# EasyEDA Pro project ProProject_ReuleauxTriangle_2023-12-03.epro

# Schematic Schematic1
Create Date: 2023-11-23; Page Name: P1; Project Name: ReuleauxTriangle; Schematic Name: Schematic1; Update Date: 2023-11-29; Company: 嘉立创EDA; Page Size: A4; Version: V1.0
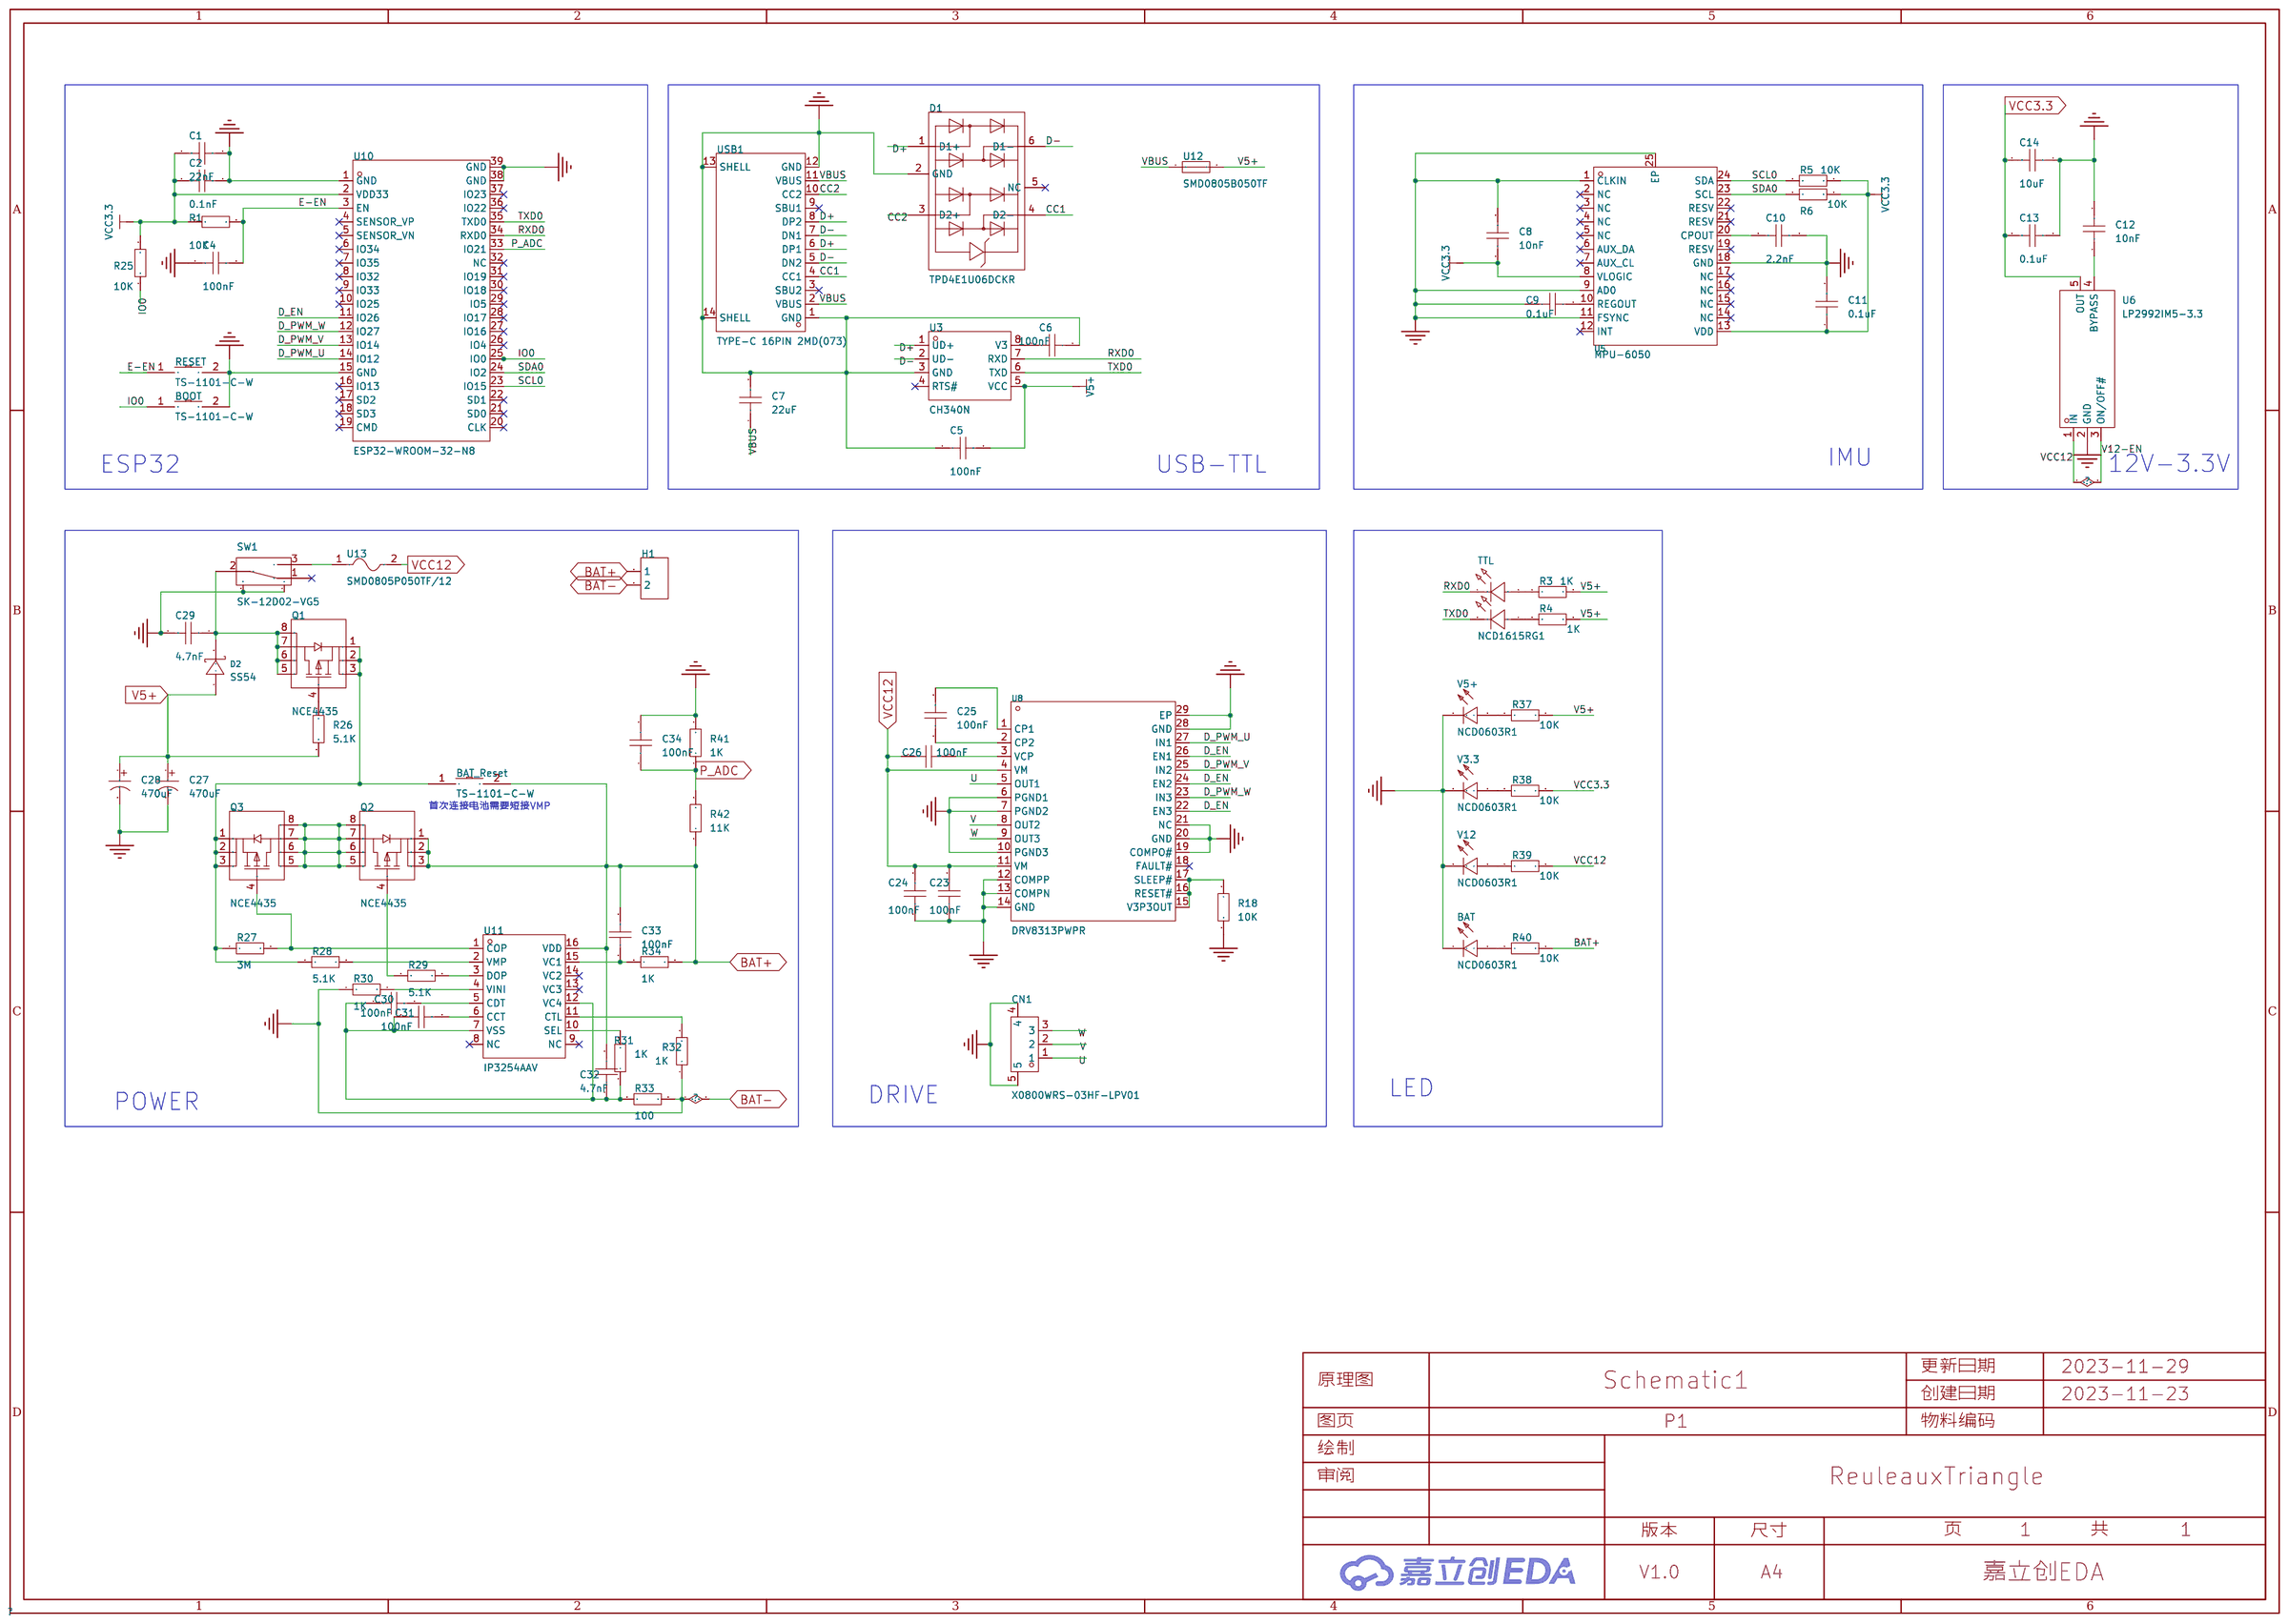
[diagram p0: schematic sheet]

## Parts
BAT  NCD0603R1  [LED0603-RD_RED]
BAT_Reset  TS-1101-C-W  [SW-SMD_L6.0-W3.3-LS8.0]
BOOT  TS-1101-C-W  [SW-SMD_L6.0-W3.3-LS8.0]
C1  22nF  [C0402]
C2  0.1nF  [C0402]
C4  100nF  [C0402]
C5  100nF  [C0402]
C6  100nF  [C0402]
C7  22uF  [C0402]
C8  10nF  [C0402]
C9  0.1uF  [C0402]
C10  2.2nF  [C0402]
C11  0.1uF  [C0402]
C12  10nF  [C0402]
C13  0.1uF  [C0402]
C14  10uF  [C0402]
C23  100nF  [C0402]
C24  100nF  [C0402]
C25  100nF  [C0402]
C26  100nF  [C0402]
C27  470uF  [CAP-SMD_BD10.0-L10.3-W10.3-FD]
C28  470uF  [CAP-SMD_BD10.0-L10.3-W10.3-FD]
C29  4.7nF  [C0402]
C30  100nF  [C0402]
C31  100nF  [C0402]
C32  4.7nF  [C0402]
C33  100nF  [C0402]
C34  100nF  [C0402]
CN1  X0800WRS-03HF-LPV01  [CONN-SMD_X0800WRS-03HF-LPV01]
D1  TPD4E1U06DCKR  [SC-70-6_L2.2-W1.3-P0.65-LS2.1-BL]
D2  SS54  [SMA_L4.4-W2.8-LS5.4-R-RD]
H1  -  [HDR-TH_2P-P2.54-V-F]
Q1  NCE4435  [SOP-8_L5.0-W4.0-P1.27-LS6.2-BL]
Q2  NCE4435  [SOP-8_L5.0-W4.0-P1.27-LS6.2-BL]
Q3  NCE4435  [SOP-8_L5.0-W4.0-P1.27-LS6.2-BL]
R1  10K  [R0402]
R3  1K  [R0402]
R4  1K  [R0402]
R5  10K  [R0402]
R6  10K  [R0402]
R18  10K  [R0402]
R25  10K  [R0402]
R26  5.1K  [R0402]
R27  3M  [R0402]
R28  5.1K  [R0402]
R29  5.1K  [R0402]
R30  1K  [R0402]
R31  1K  [R0402]
R32  1K  [R0402]
R33  100  [R0402]
R34  1K  [R0402]
R37  10K  [R0402]
R38  10K  [R0402]
R39  10K  [R0402]
R40  10K  [R0402]
R41  1K  [R0402]
R42  11K  [R0402]
RESET  TS-1101-C-W  [SW-SMD_L6.0-W3.3-LS8.0]
SW1  SK-12D02-VG5  [SW-TH_SK-12D02-VG5]
TTL  NCD1615RG1  [LED-SMD_4P-L1.6-W1.5-TL-1]
U3  CH340N  [SOP-8_L4.9-W3.9-P1.27-LS6.0-BL]
U5  MPU-6050  [QFN-24_L4.0-W4.0-P0.50-BL-EP2.7]
U6  LP2992IM5-3.3  [SOT-23-5_L2.9-W1.6-P0.95-LS2.8-BL]
U8  DRV8313PWPR  [HTSSOP-28_L9.8-W4.5-P0.65-LS6.6-BL-EP]
U10  ESP32-WROOM-32-N8  [WIFIM-SMD_39P-L25.5-W18.0-P1.27]
U11  IP3254AAV  [TSSOP-16_L5.0-W4.4-P0.65-LS6.4-BL]
U12  SMD0805B050TF  [F0805]
U13  SMD0805P050TF/12  [F0805]
USB1  TYPE-C 16PIN 2MD(073)  [USB-C-SMD_TYPE-C-6PIN-2MD-073]
V3.3  NCD0603R1  [LED0603-RD_RED]
V5+  NCD0603R1  [LED0603-RD_RED]
V12  NCD0603R1  [LED0603-RD_RED]

## Library data of the parts
BAT V3.3 V5+ V12 = NCD0603R1_C84263: 发光颜色:红色;功率:65mW;透镜颜色:无色透明;主波长:615nm~630nm;发光强度:80mcd~220mcd;发光角度:130°;工作温度:-30℃~+85℃;; LCSC Part Name: 红灯 0603红灯   正贴; Supplier Part: C84263; Manufacturer: 国星光电; Supplier Footprint: 0603; JLCPCB Part Class: Extended Part; Datasheet: https://atta.szlcsc.com/upload/public/pdf/source/20200820/C84263_DABC6A75E58F576973B407FDBA283D60.pdf; Supplier: LCSC; Emitted Color: 红色; Forward Voltage (VF): 1.6V~2.6V; Forward Current: 20mA; Power Dissipation: 65mW; Lens Color: 无色透明; Dominant Wavelength: 615nm~630nm; Luminous Intensity: 80mcd~220mcd; Viewing Angle: 130°; Operating Temperature: -30℃~+85℃
BAT_Reset BOOT RESET = TS-1101-C-W: 电路结构:单刀单掷;带支架:否;触点电流:50mA;额定电压(AC):-;额定电压(DC):12V;额定功率:-;安装方式:立贴;绝缘电阻:-;带灯:无;作用力:260gf;机械寿命:5万次;; LCSC Part Name: 6*3.6*2.5mm 立贴 轻触开关 白色带淡绿按键 卷装; Supplier Part: C318938; Manufacturer: XKB Connectivity(中国星坤); Supplier Footprint: SMD; JLCPCB Part Class: Extended Part; Datasheet: https://atta.szlcsc.com/upload/public/pdf/source/20200227/C318938_C2E53B1EEDE37D980A33616AC086DE53.pdf; Supplier: LCSC; Circuit: 单刀单掷; Actuator Style: 矩形按钮; Switch Length: 6mm; Switch Width: 3.6mm; Switch Height: 2.5mm; Strike Gundam: 否; Contact Current: 50mA; Voltage Rating (DC): 12V; Mounting Style: 立贴; Actuator/Cap Color: 白色带淡绿; With Lamp: 无; Operating Force: 260gf; Mechanical Life: 5万次; Operating Temperature: -30℃~+85℃
C1 C2 C4-C14 C23-C26 C29-C34 = CAP_0402: Supplier Footprint: 0402
C27 C28 = RVT1V471M1010: 容值:470uF;精度:±20%;额定电压:35V;纹波电流:-;等效串联电阻:-;; LCSC Part Name: 470uF ±20% 35V; Supplier Part: C3350; Manufacturer: HONOR(荣誉); Supplier Footprint: SMD,D10xL10.2mm; JLCPCB Part Class: Extended Part; Datasheet: https://atta.szlcsc.com/upload/public/pdf/source/20210521/C113284_25C86AE95FB541053FE695F13EA8E7D0.pdf; Supplier: LCSC; Tolerance: ±20%; Rated Voltage: 35V; φD: 10mm; L: 10.2mm; Lifetime @ Temp: 2000hrs@105℃; Operating Temperature: -55℃~+105℃
CN1 = X0800WRS-03HF-LPV01: 参考系列:-;间距:0.8mm;插针结构:1x3P;排数:1;每排PIN数:3;行距:-;公母:公型插针;安装方式:卧贴;额定电流:500mA;触头材质:磷青铜;触头镀层:金;工作温度范围:-25℃~+85℃;焊接温度(最大值):260℃;; LCSC Part Name: 间距:0.8mm 1x3P 卧贴 镀金 替代JST; Supplier Part: C500138; Manufacturer: XKB Connectivity(中国星坤); Supplier Footprint: SMD,P=0.8mm; JLCPCB Part Class: Extended Part; Datasheet: https://atta.szlcsc.com/upload/public/pdf/source/20211011/3A0802A09DD608D3DCC2D13C156B7911.pdf; Supplier: LCSC; Pitch: 0.8mm; Pins Structure: 1x3P; Number of Rows: 1; Number of PINs Per Row: 3; Gender: 公型插针; Mounting Style: 卧贴; Current Rating (Max): 500mA; Contact Material: 磷青铜; Contact Plating: 金; Operating Temperature Range: -25℃~+85℃; Welding Temperature (Max): 260℃
D1 = TPD4E1U06DCKR: 极性:单向;反向截止电压(Vrwm):5.5V;击穿电压(VBR):6.5V;钳位电压(Vc)@Ipp:15V;; LCSC Part Name: 单向ESD; Supplier Part: C194628; Manufacturer: TI(德州仪器); Supplier Footprint: SOT-363; JLCPCB Part Class: Extended Part; Datasheet: https://atta.szlcsc.com/upload/public/pdf/source/20180625/C194628_A458CD25029D59CDC67787AEC4B36401.pdf; Supplier: LCSC; Polarity: 单向; Reverse Stand-Off Voltage (Vrwm): 5.5V; Breakdown Voltage (VBR): 6.5V; Peak Pulse Current(Ipp)@8/20us: 3A; Clamping Voltage@Ipp: 15V; Peak Pulse Power(Ppp)@8/20us: 45W; Operating Temperature: -40℃~+125℃@(Ta)
D2 = SS54_C22452: 直流反向耐压（Vr）:40V;平均整流电流（Io）:5A;正向压降（Vf）:550mV @ 5A;; Supplier Part: C22452; Manufacturer: MDD; Supplier Footprint: SMA(DO-214AC); JLCPCB Part Class: Basic Part; Supplier: LCSC
H1 = HDR-F_2.54_1x2P: Supplier Part: C49661; Supplier Footprint: 插件
Q1-Q3 = NCE4435: 类型:P沟道;漏源电压(Vdss):30V;连续漏极电流(Id):9.1A;功率(Pd):3.1W;导通电阻(RDS(on)@Vgs,Id):20mΩ@10V,9.1A;阈值电压(Vgs(th)@Id):3V@250uA;; LCSC Part Name: P沟道 30V 9.1A; Supplier Part: C95275; Manufacturer: NCE(无锡新洁能); Supplier Footprint: SOP-8; JLCPCB Part Class: 扩展库; Datasheet: https://atta.szlcsc.com/upload/public/pdf/source/20170211/1486785674640.pdf; Supplier: LCSC; Type: P沟道; Drain Source Voltage (Vdss): 30V; Continuous Drain Current (Id): 9.1A; Power Dissipation (Pd): 3.1W; Drain Source On Resistance (RDS(on)@Vgs,Id): 20mΩ@10V,9.1A; Gate Threshold Voltage (Vgs(th)@Id): 3V@250uA
R1 R3-R6 R18 R25-R34 R37-R42 = Res_0402: Supplier Footprint: 0402
SW1 = SK-12D02-VG5_C136722: 额定电流(DC):-;额定电压(DC):-;额定电流(AC):-;额定电压(AC):-;电路结构:单刀双掷;安装方式:卧插;机械寿命:5千次;; LCSC Part Name: 卧插双档 滑动开关; Supplier Part: C136722; Manufacturer: 韩国韩荣; Supplier Footprint: 插件; JLCPCB Part Class: 扩展库; Datasheet: https://atta.szlcsc.com/upload/public/pdf/source/20180731/C136723_39114FC09BF2E9DC98823B78B7234B45.pdf; Supplier: LCSC; Circuit: 单刀双掷; Mounting Style: 卧插; Mechanical Life: 5千次; Actuator Style: 矩形柱状; Pin Style: PC引脚; Operating Temperature: -25℃~+70℃; Switch Height: 9.5mm
TTL = NCD1615RG1: 发光颜色:橙红色,翠绿色;二极管配置:-;功率:72mW；52mW;透镜颜色:-;主波长:625nm；525nm;色温:-;发光强度:260mcd；150mcd;发光角度:130°;安装方式:-;工作温度:-30℃~+85℃;; LCSC Part Name: 红灯,翠绿 正贴 1615  双色LED; Supplier Part: C2917181; Manufacturer: 国星光电; Supplier Footprint: 0606; JLCPCB Part Class: Extended Part; Datasheet: https://atta.szlcsc.com/upload/public/pdf/source/20211124/E2F3DD35E9AE2C38D361CFFAAFF6A77F.pdf; Supplier: LCSC; Emitted Color: 橙红色,翠绿色; Forward Voltage (VF): 3.2V；2V; Forward Current: 20mA; Power Dissipation: 72mW；52mW; Dominant Wavelength: 625nm；525nm; Luminous Intensity: 260mcd；150mcd; Viewing Angle: 130°; Operating Temperature: -30℃~+85℃
U3 = CH340N: LCSC Part Name: USB转串口芯片 CH340; Supplier Part: C2977777; Manufacturer: WCH(南京沁恒); Supplier Footprint: SOP-8; JLCPCB Part Class: 扩展库; Datasheet: https://atta.szlcsc.com/upload/public/pdf/source/20230530/6E401E9554E9F5311886CC8B3F89B62E.pdf; Supplier: LCSC
U5 = MPU-6050: 三轴加速度计和三轴陀螺仪，工作电压：2.375V~3.46V; Supplier Part: C24112; Manufacturer: TDK InvenSense(应美盛); Supplier Footprint: QFN-24(4x4); JLCPCB Part Class: 扩展库; Datasheet: https://atta.szlcsc.com/upload/public/pdf/source/20140425/1457707046159.pdf; Supplier: LCSC
U6 = LP2992IM5-3.3: 输出类型:固定;输出极性:正;最大输入电压:16V;输出电压:3.3V;输出电流:250mA;电源纹波抑制比(PSRR):45dB@(1kHz);; Supplier Part: C3751592; Manufacturer: TI(德州仪器); Supplier Footprint: SOT-23-5; JLCPCB Part Class: 扩展库; Supplier: LCSC; Output Type: 固定; Output Polarity: 正; Number of Outputs: 1; Maximum Input Voltage: 16V; Output Voltage: 3.3V; Dropout Voltage: 850mV@(250mA); Quiescent Current (Ground Current): 95uA; Output Current: 250mA; Power Supply Rejection Ratio (PSRR): 45dB@(1kHz); Feature: 过流保护；过热保护; Operating Temperature: -40℃~+125℃@(Tj)
U8 = DRV8313PWPR: 类型:无刷直流BLDC;电源电压:8V~60V;输出电流:-;接口:并行;; LCSC Part Name: 无刷直流BLDC电机驱动芯片 60V; Supplier Part: C92482; Manufacturer: TI(德州仪器); Supplier Footprint: TSSOP-28-EP; JLCPCB Part Class: 扩展库; Datasheet: https://www.ti.com/cn/lit/gpn/drv8313; Supplier: LCSC; Type: 无刷直流BLDC; Supply Voltage: 8V~60V; Interface: 并行; Operating Temperature: -40℃~+150℃@(Tj)
U10 = ESP32-WROOM-32-N8: Supplier Part: C529582; Manufacturer: ESPRESSIF(乐鑫); Supplier Footprint: SMD,18x25.5mm; JLCPCB Part Class: Extended Part; Datasheet: https://atta.szlcsc.com/upload/public/pdf/source/20200521/C529581_8F7B9F041ADB7CF235FBC8D159B9C4FF.pdf; Supplier: LCSC
U11 = IP3254AAV: Supplier Part: C384569; Manufacturer: INJOINIC(英集芯); Supplier Footprint: TSSOP-16; JLCPCB Part Class: 扩展库; Datasheet: https://atta.szlcsc.com/upload/public/pdf/source/20190627/C384569_A25975C6DA0D38CB62CDBD6469AC3DAB.pdf; Supplier: LCSC
U12 = SMD0805B050TF: 最大电压:6V;最大电流:100A;保持电流:500mA;跳闸电流:1A;; LCSC Part Name: 6V 500mA 0805自恢复; Supplier Part: C269104; Manufacturer: Brightking(君耀电子); Supplier Footprint: 0805; JLCPCB Part Class: 扩展库; Datasheet: https://atta.szlcsc.com/upload/public/pdf/source/20180814/C269104_466839A5DB65F6E723CA6A162ACE747B.pdf; Supplier: LCSC; Operating Voltage (Max): 6V; Current Rating (Max): 100A; Hold Current: 500mA; Trip Current: 1A; Maximum Time to Trip: 100ms
U13 = SMD0805P050TF/12: 最大电压:12V;最大电流:100A;保持电流:500mA;跳闸电流:1A;; LCSC Part Name: 12V 500mA 0805自恢复; Supplier Part: C90129; Manufacturer: RUILON(瑞隆源); Supplier Footprint: 0805; JLCPCB Part Class: Extended Part; Datasheet: https://atta.szlcsc.com/upload/public/pdf/source/20180621/C90129_682C2B239333F36385CA0609A87C55A0.pdf; Supplier: LCSC; Operating Voltage (Max): 12V; Current Rating (Max): 100A; Hold Current: 500mA; Trip Current: 1A
USB1 = TYPE-C 16PIN 2MD(073): 连接器类型:Type-C;标准:-;公母:母;触点数量:16P;端口数量:1;安装方式:卧贴;额定电流 - 电源:5A;工作温度范围:-25℃~+85℃;; LCSC Part Name: Type-C 母 卧贴 带定位柱 不锈钢外壳 2次模顶; Supplier Part: C2765186; Manufacturer: SHOU HAN(首韩); Supplier Footprint: SMD; JLCPCB Part Class: 扩展库; Datasheet: https://atta.szlcsc.com/upload/public/pdf/source/20211123/39B17C16241EAC15C5E277BDA434118E.pdf; Supplier: LCSC; Connector Type: Type-C; Gender: 母; Number of Contacts: 16P; Number of Ports: 1; Mounting Style: 卧贴; Current Rating - Power (Max): 5A; Operating Temperature Range: -25℃~+85℃

## Nets
GND: BAT.1(K) BOOT.2 C1.1 C2.2 C4.1 C5.1 C6.2 C7.2 C8.2 C9.1 C10.2 C11.2 C12.2 C13.1 C14.1 C23.1 C24.1 C27.2 C28.2 C29.2 C34.2 CN1.4 CN1.5 D1.2(GND) H1.2 R18.2 R30.1 R32.1 R33.2 R41.2 RESET.2 SW1.4 SW1.5 U3.3(GND) U5.1(CLKIN) U5.9(AD0) U5.11(FSYNC) U5.18(GND) U5.25(EP) U6.2(GND) U8.6(PGND1) U8.7(PGND2) U8.10(PGND3) U8.12(COMPP) U8.13(COMPN) U8.14(GND) U8.19(COMPO#) U8.20(GND) U8.21(NC) U8.28(GND) U8.29(EP) U10.1(GND) U10.15(GND) U10.38(GND) U10.39(GND) USB1.1(GND) USB1.12(GND) USB1.13(SHELL) USB1.14(SHELL) V3.3.1(K) V5+.1(K) V12.1(K)
V5+: C5.2 C27.1 C28.1 D2.1(A) R3.2 R4.2 R26.2 R37.2 U3.5(VCC) U12.2
V12-EN: C23.2 C24.2 C26.1 R39.2 U6.1(IN) U6.3(ON/OFF#) U8.4(VM) U8.11(VM) U13.2
VBUS: C7.1 U12.1 USB1.2(VBUS) USB1.11(VBUS)
VCC3.3: C1.2 C2.1 C8.1 C11.1 C13.2 C14.2 R1.1 R5.2 R6.2 R25.2 R38.2 U5.8(VLOGIC) U5.13(VDD) U6.5(OUT) U10.2(VDD33)
BAT+: BAT_Reset.2 C32.2 C33.2 H1.1 Q2.1(S) Q2.2(S) Q2.3(S) R34.2 R40.2 R42.1 U11.16(VDD)
CC1: D1.4(D2-) USB1.4(CC1)
CC2: D1.3(D2+) USB1.10(CC2)
D+: D1.1(D1+) U3.1(UD+) USB1.6(DP1) USB1.8(DP2)
D-: D1.6(D1-) U3.2(UD-) USB1.5(DN2) USB1.7(DN1)
D_EN: U8.22(EN3) U8.24(EN2) U8.26(EN1) U10.11(IO26)
D_PWM_U: U8.27(IN1) U10.14(IO12)
D_PWM_V: U8.25(IN2) U10.13(IO14)
D_PWM_W: U8.23(IN3) U10.12(IO27)
E-EN: C4.2 R1.2 RESET.1 U10.3(EN)
IO0: BOOT.1 R25.1 U10.25(IO0)
P_ADC: C34.1 R41.1 R42.2 U10.33(IO21)
RXD0: TTL.1(R-) U3.7(RXD) U10.34(RXD0)
SCL0: R5.1 U5.24(SDA) U10.23(IO15)
SDA0: R6.1 U5.23(SCL) U10.24(IO2)
TXD0: TTL.3(UG-) U3.6(TXD) U10.35(TXD0)
U: CN1.1 U8.5(OUT1)
V: CN1.2 U8.8(OUT2)
W: CN1.3 U8.9(OUT3)
$1N4426: C6.1 U3.8(V3)
$1N4742: R3.1 TTL.2(+R)
$1N4768: R4.1 TTL.4(+UG)
$1N6012: C9.2 U5.10(REGOUT)
$1N6344: C10.1 U5.20(CPOUT)
$1N6735: C12.1 U6.4(BYPASS)
$1N10947: R18.1 U8.15(V3P3OUT) U8.16(RESET#) U8.17(SLEEP#)
$1N11170: C25.2 U8.1(CP1)
$1N11174: C25.1 U8.2(CP2)
$1N11246: C26.2 U8.3(VCP)
$1N21068: Q1.4(G) R26.1
$1N21616: Q2.5(D) Q2.6(D) Q2.7(D) Q2.8(D) Q3.5(D) Q3.6(D) Q3.7(D) Q3.8(D)
$1N22205: Q2.4(G) R29.1
$1N22284: R28.2 U11.2(VMP)
$1N22287: R29.2 U11.3(DOP)
$1N22338: R30.2 U11.4(VINI)
$1N22413: C30.2 U11.5(CDT)
$1N22416: C31.2 U11.6(CCT)
$1N22526: R31.2 U11.10(SEL)
$1N22587: R32.2 U11.11(CTL)
$1N22677: C30.1 C31.1 C32.1 R31.1 R33.1 U11.7(VSS) U11.12(VC4)
$1N22806: C33.1 R34.1 U11.15(VC1)
$1N23187: BAT_Reset.1 Q1.1(S) Q1.2(S) Q1.3(S) Q3.1(S) Q3.2(S) Q3.3(S) R27.1 R28.1
$1N23372: C29.1 D2.2(K) Q1.5(D) Q1.6(D) Q1.7(D) Q1.8(D) SW1.2
$1N23637: Q3.4(G) R27.2 U11.1(COP)
$1N23749: R37.1 V5+.2(A)
$1N23775: R38.1 V3.3.2(A)
$1N23930: R39.1 V12.2(A)
$1N24036: BAT.2(A) R40.1
$1N25830: SW1.3 U13.1

Not connected (* = marked no-connect by the designer): D1 5(NC)*; SW1 1*; U3 4(RTS#)*; U5 2(NC)* 3(NC)* 4(NC)* 5(NC)* 6(AUX_DA)* 7(AUX_CL)* 12(INT)* 14(NC)* 15(NC)* 16(NC)* 17(NC)* 19(RESV)* 21(RESV)* 22(RESV)*; U8 18(FAULT#)*; U10 4(SENSOR_VP)* 5(SENSOR_VN)* 6(IO34)* 7(IO35)* 8(IO32)* 9(IO33)* 10(IO25)* 16(IO13)* 17(SD2)* 18(SD3)* 19(CMD)* 20(CLK)* 21(SD0)* 22(SD1)* 26(IO4)* 27(IO16)* 28(IO17)* 29(IO5)* 30(IO18)* 31(IO19)* 32(NC)* 36(IO22)* 37(IO23)*; U11 8(NC)* 9(NC)* 13(VC3)* 14(VC2)*; USB1 3(SBU2)* 9(SBU1)*

## Notes on the sheet
- IMU
- 12V-3.3V
- ESP32
- USB-TTL
- 首次连接电池需要短接VMP
- LED
- POWER
- DRIVE

# Board PCB4
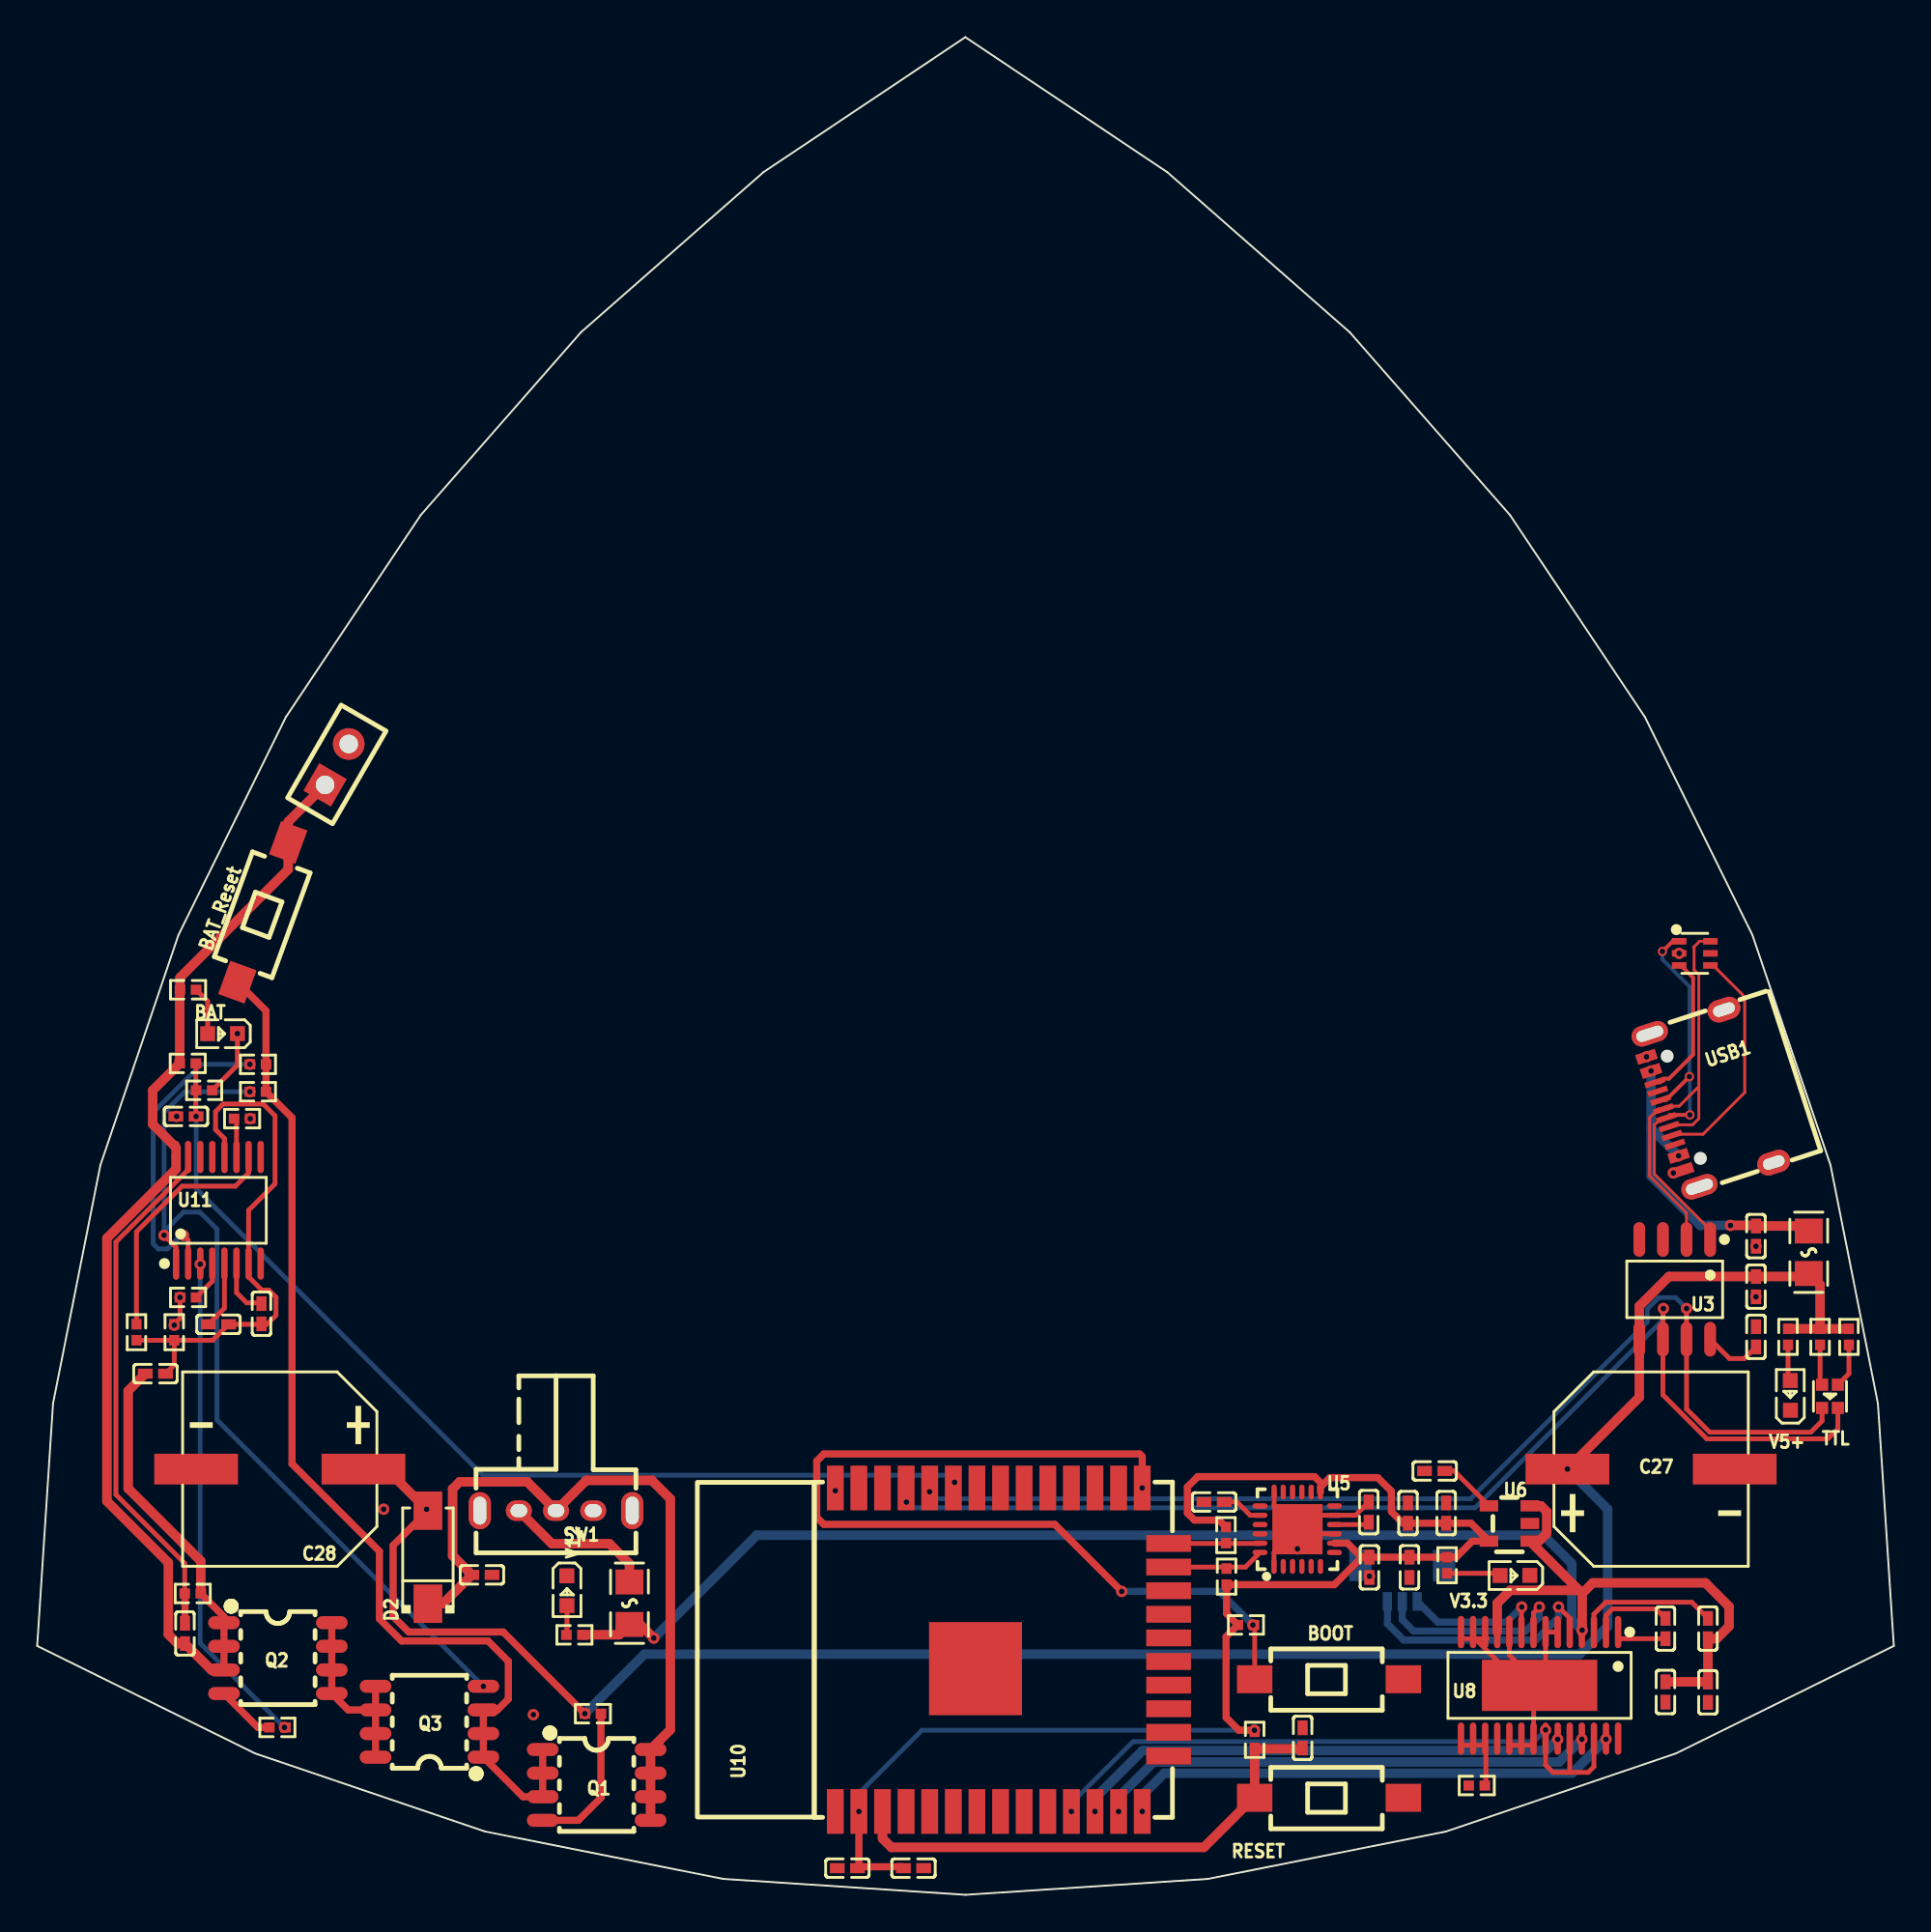
[diagram p1: board, top side]
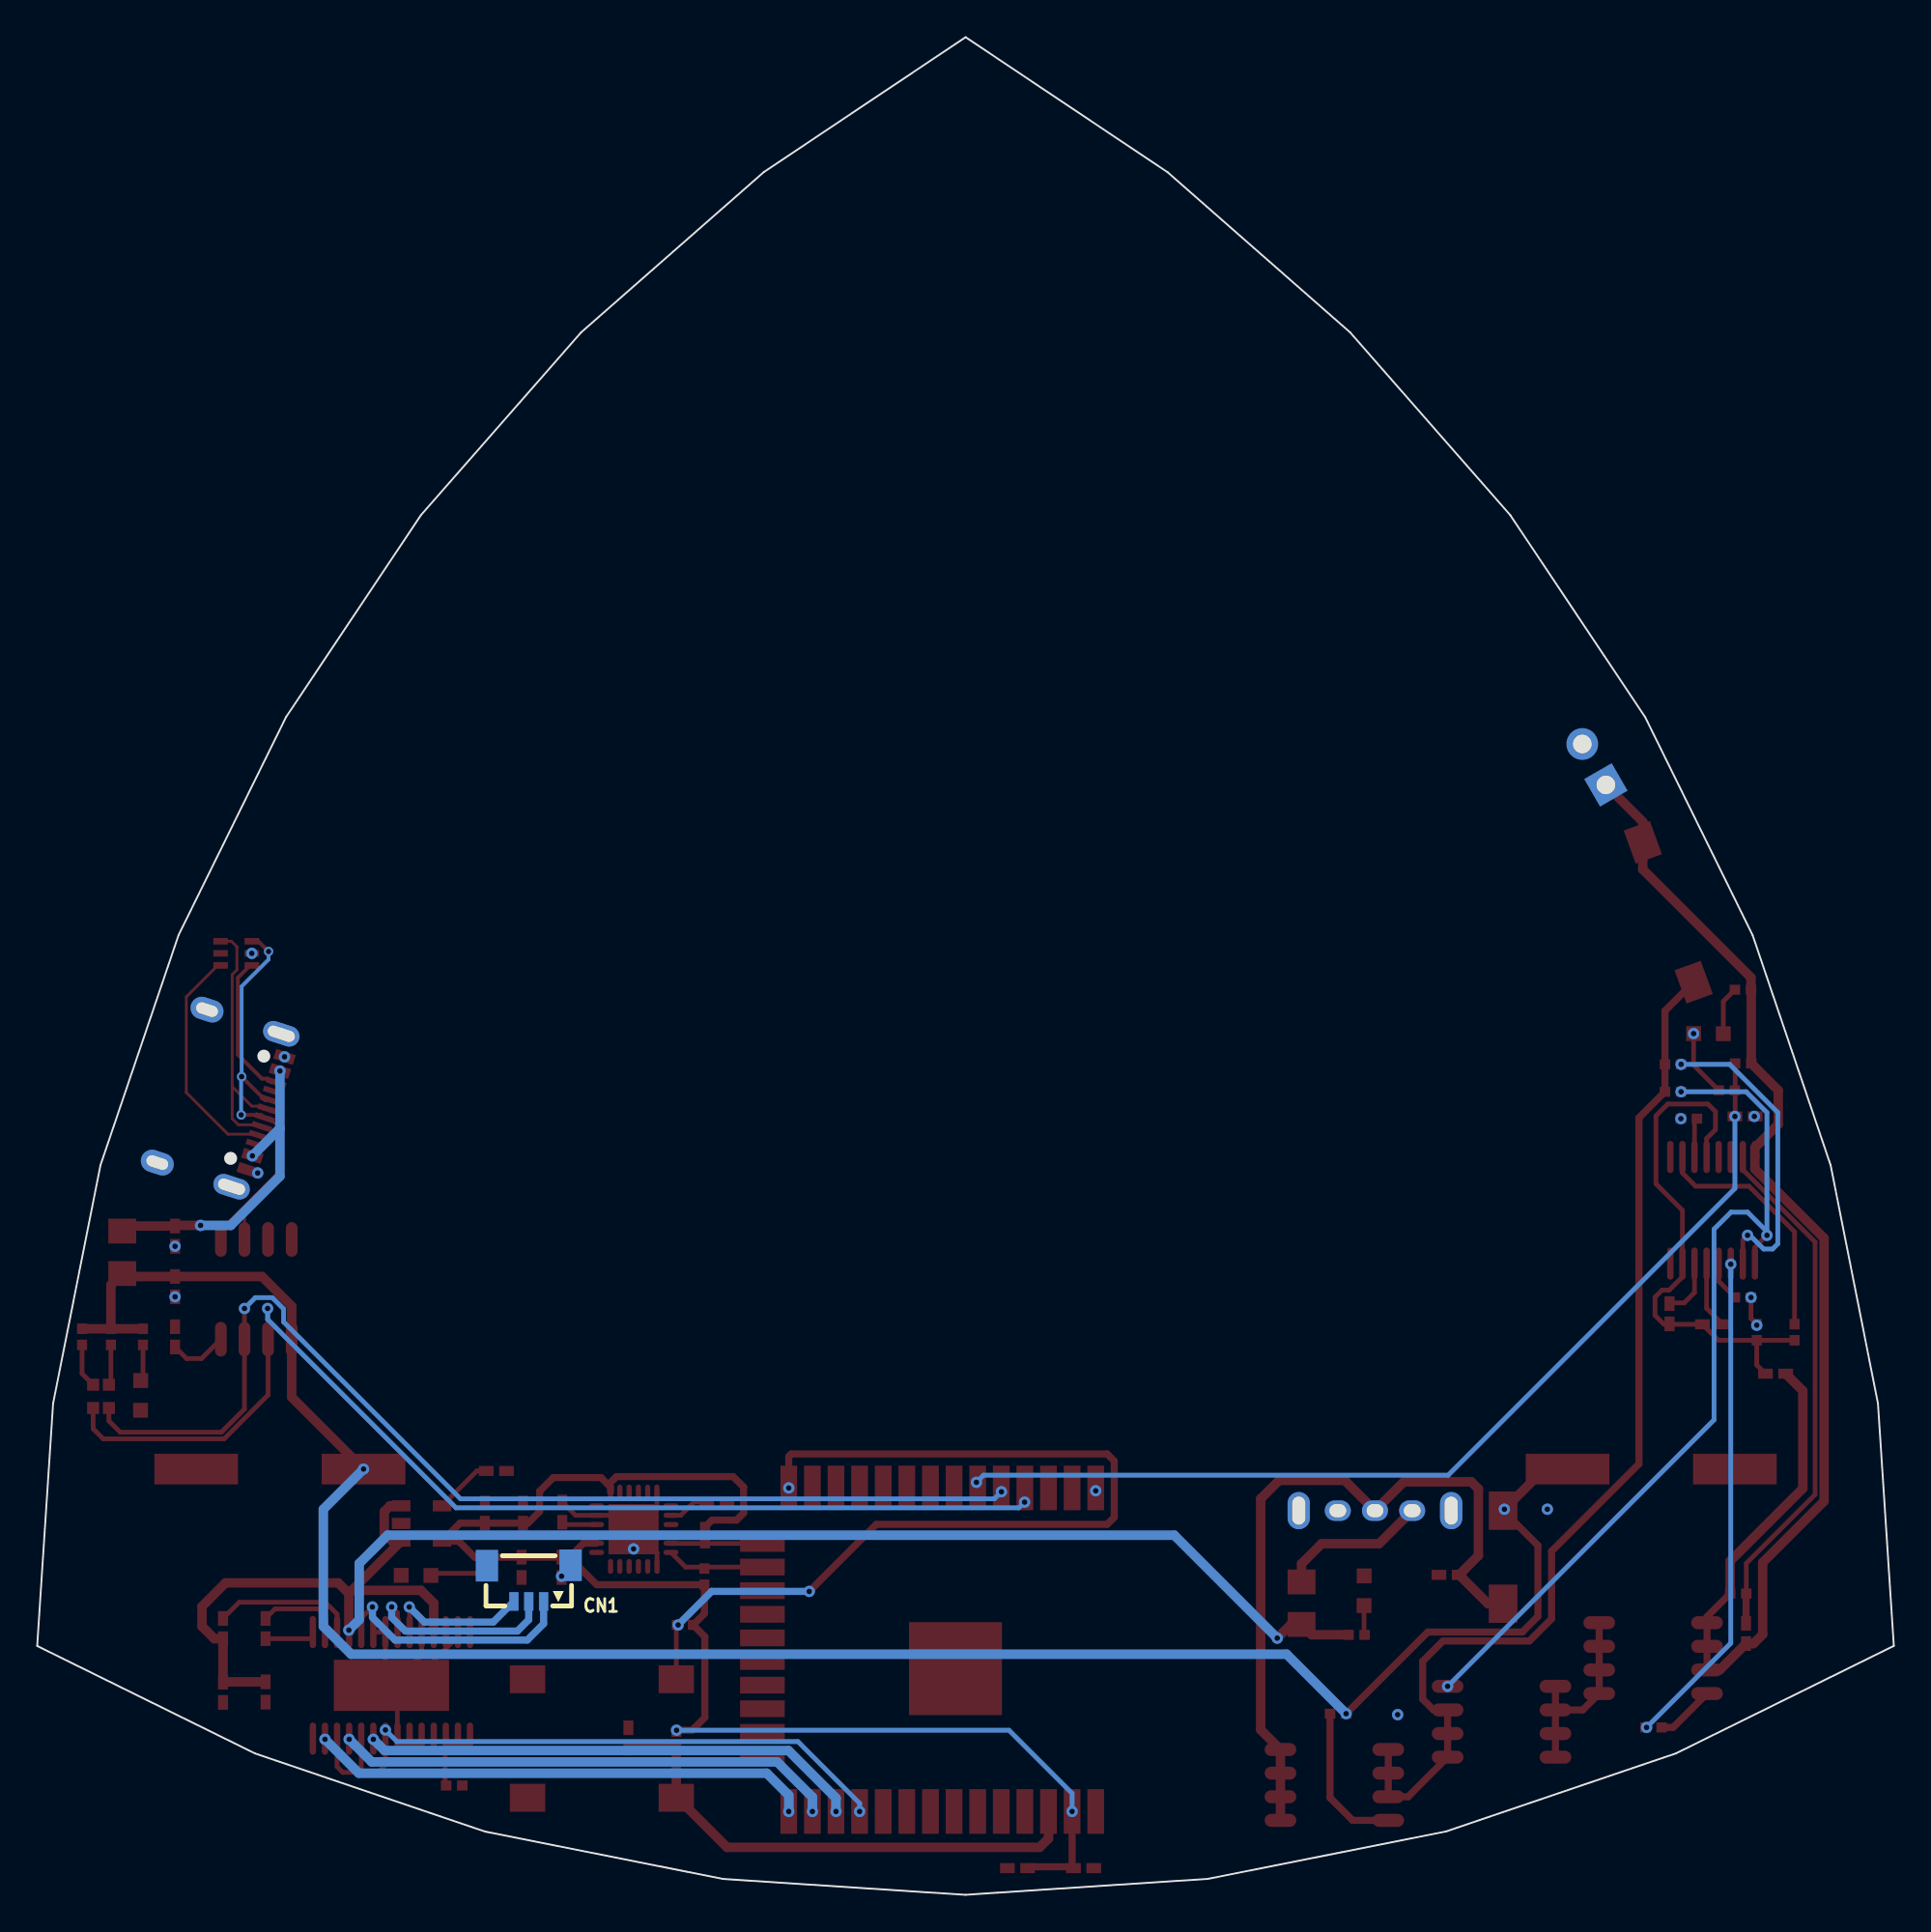
[diagram p2: board, bottom side, seen from below]

Outline 99.86 x 99.91 mm; copper layers: Top Layer, Bottom Layer. Coordinates in mm from the lower left corner of the outline.
Outline path: 0,13.39 11.72,7.61 24.09,3.4 36.9,0.85 49.93,0 62.97,0.85 75.78,3.4 88.15,7.61 99.86,13.39 99.01,26.43 96.46,39.24 92.26,51.62 86.48,63.34 79.22,74.21 70.61,84.03 60.78,92.65 49.92,99.91 39.06,92.65 29.24,84.03 20.63,74.21 13.37,63.34 7.6,51.62 3.4,39.24 0.85,26.43 0,13.39
Stack: Top Layer 0.035mm / Dielectric1 1.51mm FR4 er 4.5 / Bottom Layer 0.035mm

## Design rules (mm)
template: 自定义配置
spacing copperThickness1oz (default): track to track 0.102, other pairs 0 to 0.3
spacing copperThickness2oz: track to track 0.203, other pairs 0.152 to 0.3
track width copperThickness1oz (default): min 0.127, default 0.254, max 2.54
track width copperThickness2oz: min 0.203, default 0.254, max 2.54
differential pair differentialPair (default): width min 0.127, default 0.254, max 2.54; gap min 0.152, default 0.152
via viaSize (default): diameter min 0.5, default 0.61, max 10; hole min 0.3, default 0.305, max 6.3

## Placement (name value [footprint] x y rotation side)
BAT  NCD0603R1  [LED0603-RD_RED]  9.97 46.32 180 top
BAT_Reset  TS-1101-C-W  [SW-SMD_L6.0-W3.3-LS8.0]  12.13 52.84 70 top
BOOT  TS-1101-C-W  [SW-SMD_L6.0-W3.3-LS8.0]  69.49 11.59 0 top
C1  22nF  [C0402]  43.58 1.43 0 top
C2  0.1nF  [C0402]  47.13 1.43 0 top
C4  100nF  [C0402]  68.06 8.44 270 top
C5  100nF  [C0402]  92.45 32.71 90 top
C6  100nF  [C0402]  92.45 30.01 90 top
C7  22uF  [C0402]  92.45 35.42 270 top
C8  10nF  [C0402]  73.81 17.61 270 top
C9  0.1uF  [C0402]  71.62 20.58 270 top
C10  2.2nF  [C0402]  63.31 21.13 180 top
C11  0.1uF  [C0402]  71.66 17.61 270 top
C12  10nF  [C0402]  75.17 22.8 180 top
C13  0.1uF  [C0402]  75.79 20.53 270 top
C14  10uF  [C0402]  73.73 20.53 270 top
C23  100nF  [C0402]  89.87 10.89 90 top
C24  100nF  [C0402]  87.58 10.91 90 top
C25  100nF  [C0402]  87.58 14.32 270 top
C26  100nF  [C0402]  89.87 14.32 90 top
C27  470uF  [CAP-SMD_BD10.0-L10.3-W10.3-FD]  86.81 22.9 0 top
C28  470uF  [CAP-SMD_BD10.0-L10.3-W10.3-FD]  13.05 22.9 180 top
C29  4.7nF  [C0402]  23.92 17.21 0 top
C30  100nF  [C0402]  9.75 30.68 180 top
C31  100nF  [C0402]  12.07 31.25 90 top
C32  4.7nF  [C0402]  6.36 28.03 180 top
C33  100nF  [C0402]  7.95 14.06 270 top
C34  100nF  [C0402]  8 41.86 180 top
CN1  X0800WRS-03HF-LPV01  [CONN-SMD_X0800WRS-03HF-LPV01]  73.42 16.75 0 bottom
D1  TPD4E1U06DCKR  [SC-70-6_L2.2-W1.3-P0.65-LS2.1-BL]  89.16 50.63 270 top
D2  SS54  [SMA_L4.4-W2.8-LS5.4-R-RD]  21.02 18.16 90 top
H1  -  [HDR-TH_2P-P2.54-V-F]  16.12 60.79 60 top
Q1  NCE4435  [SOP-8_L5.0-W4.0-P1.27-LS6.2-BL]  30.09 5.91 270 top
Q2  NCE4435  [SOP-8_L5.0-W4.0-P1.27-LS6.2-BL]  12.95 12.73 270 top
Q3  NCE4435  [SOP-8_L5.0-W4.0-P1.27-LS6.2-BL]  21.1 9.31 90 top
R1  10K  [R0402]  65.49 8.34 270 top
R3  1K  [R0402]  95.9 30.01 90 top
R4  1K  [R0402]  97.45 30.01 90 top
R5  10K  [R0402]  63.97 17.11 270 top
R6  10K  [R0402]  63.94 19.34 90 top
R18  10K  [R0402]  77.43 5.88 180 top
R25  10K  [R0402]  65.02 14.51 180 top
R26  5.1K  [R0402]  29.89 9.74 180 top
R27  3M  [R0402]  11.88 43.19 180 top
R28  5.1K  [R0402]  11.88 44.66 180 top
R29  5.1K  [R0402]  12.92 9 0 top
R30  1K  [R0402]  8.12 32.13 0 top
R31  1K  [R0402]  5.34 30.26 90 top
R32  1K  [R0402]  11.02 41.74 180 top
R33  100  [R0402]  7.37 30.26 90 top
R34  1K  [R0402]  8.37 16.2 0 top
R37  10K  [R0402]  94.17 30.01 90 top
R38  10K  [R0402]  75.84 17.72 90 top
R39  10K  [R0402]  28.9 13.98 0 top
R40  10K  [R0402]  8.12 48.68 180 top
R41  1K  [R0402]  8.98 43.27 0 top
R42  11K  [R0402]  8.1 44.72 0 top
RESET  TS-1101-C-W  [SW-SMD_L6.0-W3.3-LS8.0]  69.49 5.22 0 top
SW1  SK-12D02-VG5  [SW-TH_SK-12D02-VG5]  27.91 20.66 180 top
TTL  NCD1615RG1  [LED-SMD_4P-L1.6-W1.5-TL-1]  96.43 26.81 90 top
U3  CH340N  [SOP-8_L4.9-W3.9-P1.27-LS6.0-BL]  88.08 32.56 180 top
U5  MPU-6050  [QFN-24_L4.0-W4.0-P0.50-BL-EP2.7]  67.77 19.66 0 top
U6  LP2992IM5-3.3  [SOT-23-5_L2.9-W1.6-P0.95-LS2.8-BL]  79.19 19.97 90 top
U8  DRV8313PWPR  [HTSSOP-28_L9.8-W4.5-P0.65-LS6.6-BL-EP]  80.81 11.26 180 top
U10  ESP32-WROOM-32-N8  [WIFIM-SMD_39P-L25.5-W18.0-P1.27]  51.89 13.18 90 top
U11  IP3254AAV  [TSSOP-16_L5.0-W4.4-P0.65-LS6.4-BL]  9.75 36.82 0 top
U12  SMD0805B050TF  [F0805]  95.29 34.56 270 top
U13  SMD0805P050TF/12  [F0805]  31.86 15.68 270 top
USB1  TYPE-C 16PIN 2MD(073)  [USB-C-SMD_TYPE-C-6PIN-2MD-073]  89.81 42.76 108 top
V3.3  NCD0603R1  [LED0603-RD_RED]  79.49 17.18 180 top
V5+  NCD0603R1  [LED0603-RD_RED]  94.3 26.86 90 top
V12  NCD0603R1  [LED0603-RD_RED]  28.49 16.35 270 top

## Footprints (pads in the part's own frame, mm; a bottom-side part is the same pattern mirrored in y, then rotated)
C0402
  rect 0.79x0.54 smd: 1(-0.545,0) 2(0.545,0)
CAP-SMD_BD10.0-L10.3-W10.3-FD
  rect 4.5x1.65 smd: 1(-4.5,0) 2(4.5,0)
CONN-SMD_X0800WRS-03HF-LPV01
  rect 0.5x1 smd: 1(-0.8,0.973) 2(0,0.973) 3(0.8,0.973)
  rect 1.2x1.7 smd: 4(2.25,-0.95) 5(-2.25,-0.973)
F0805
  rect 1.335x1.5 smd: 1(-1.143,0) 2(1.143,0)
HDR-TH_2P-P2.54-V-F
  rect 1.7x1.7 hole 1: 1(-1.27,0)
  round 1.7 hole 1: 2(1.27,0)
HTSSOP-28_L9.8-W4.5-P0.65-LS6.6-BL-EP
  oval 0.343x1.732 smd: 1(-4.225,-2.866) 2(-3.575,-2.866) 3(-2.925,-2.866) 4(-2.275,-2.866) 5(-1.625,-2.866) 6(-0.975,-2.866) 7(-0.325,-2.866) 8(0.325,-2.866) 9(0.975,-2.866) 10(1.625,-2.866) 11(2.275,-2.866) 12(2.925,-2.866) 13(3.575,-2.866) 14(4.225,-2.866) 15(4.225,2.866) 16(3.575,2.866) 17(2.925,2.866) 18(2.275,2.866) 19(1.625,2.866) 20(0.975,2.866) 21(0.325,2.866) 22(-0.325,2.866) 23(-0.975,2.866) 24(-1.625,2.866) 25(-2.275,2.866) 26(-2.925,2.866) 27(-3.575,2.866) 28(-4.225,2.866)
  rect 6.2x2.75 smd: 29(0,0)
LED0603-RD_RED
  rect 0.8x0.8 smd: 1(-0.799,-0.004) 2(0.799,0.004)
LED-SMD_4P-L1.6-W1.5-TL-1
  rect 0.65x0.65 smd: 1(-0.625,0.425) 2(0.625,0.425) 3(-0.625,-0.425) 4(0.625,-0.425)
QFN-24_L4.0-W4.0-P0.50-BL-EP2.7
  oval 0.28x0.8 smd: 1(-1.25,-2) 2(-0.75,-2) 3(-0.25,-2) 4(0.25,-2) 5(0.75,-2) 6(1.25,-2) 13(1.25,2) 14(0.75,2) 15(0.25,2) 16(-0.25,2) 17(-0.75,2) 18(-1.242,2)
  oval 0.8x0.28 smd: 7(2,-1.25) 8(2,-0.75) 9(2,-0.25) 10(2,0.25) 11(2,0.75) 12(2,1.25) 19(-2,1.25) 20(-2,0.75) 21(-2,0.25) 22(-2,-0.25) 23(-2,-0.75) 24(-2,-1.25)
  rect 2.7x2.7 smd: 25(0.013,0)
R0402
  rect 0.566x0.54 smd: 1(-0.433,0) 2(0.433,0)
SC-70-6_L2.2-W1.3-P0.65-LS2.1-BL
  rect 0.35x0.78 smd: 1(-0.65,-0.84) 2(0,-0.84) 3(0.65,-0.84) 4(0.65,0.84) 5(0,0.84) 6(-0.65,0.84)
SMA_L4.4-W2.8-LS5.4-R-RD
  rect 2.062x1.539 smd: 1(2.503,0) 2(-2.503,0)
SOP-8_L4.9-W3.9-P1.27-LS6.0-BL
  oval 0.63x1.865 smd: 1(-1.905,-2.683) 2(-0.635,-2.683) 3(0.635,-2.683) 4(1.905,-2.683) 5(1.905,2.683) 6(0.635,2.683) 7(-0.635,2.683) 8(-1.905,2.683)
SOP-8_L5.0-W4.0-P1.27-LS6.2-BL
  oval 0.7x1.7 smd: 1(-1.905,-2.9) 2(-0.635,-2.9) 3(0.635,-2.9) 4(1.905,-2.9) 5(1.905,2.9) 6(0.635,2.9) 7(-0.635,2.9) 8(-1.905,2.9)
SOT-23-5_L2.9-W1.6-P0.95-LS2.8-BL
  rect 0.6x1 smd: 1(-0.95,-1.1) 2(0,-1.1) 3(0.95,-1.1) 4(0.95,1.1) 5(-0.95,1.1)
SW-SMD_L6.0-W3.3-LS8.0
  rect 1.9x1.5 smd: 1(-4,0) 2(4,0)
SW-TH_SK-12D02-VG5
  oval 1.4x1.1 hole 0.9x0.7: 1(-2,0) 2(0.001,0) 3(2,0)
  oval 1.2x2 hole 0.7x1.5: 4(4.1,0) 5(-4.1,0)
TSSOP-16_L5.0-W4.4-P0.65-LS6.4-BL
  oval 0.343x1.732 smd: 1(-2.275,-2.866) 2(-1.625,-2.866) 3(-0.975,-2.866) 4(-0.325,-2.866) 5(0.325,-2.866) 6(0.975,-2.866) 7(1.625,-2.866) 8(2.275,-2.866) 9(2.275,2.866) 10(1.625,2.866) 11(0.975,2.866) 12(0.325,2.866) 13(-0.325,2.866) 14(-0.975,2.866) 15(-1.625,2.866) 16(-2.275,2.866)
USB-C-SMD_TYPE-C-6PIN-2MD-073
  rect 0.55x1.1 smd: 1(-3.2,2.375) 2(-2.4,2.375) 11(2.4,2.375) 12(3.2,2.375)
  rect 0.3x1.1 smd: 3(-1.75,2.375) 4(-1.25,2.375) 5(-0.75,2.375) 6(-0.25,2.375) 7(0.25,2.375) 8(0.75,2.375) 9(1.25,2.375) 10(1.75,2.375)
  oval 1.2x1.8 hole 0.6x1.2: 13(-4.325,-2.375) 14(4.325,-2.375)
  oval 1.1x2 hole 0.6x1.5: 13(-4.325,1.825) 14(4.325,1.825)
WIFIM-SMD_39P-L25.5-W18.0-P1.27
  rect 2.4x0.9 smd: 1(-8.7,8.965) 2(-8.7,7.695) 3(-8.7,6.425) 4(-8.7,5.155) 5(-8.7,3.885) 6(-8.7,2.615) 7(-8.7,1.345) 8(-8.7,0.075) 9(-8.7,-1.195) 10(-8.7,-2.465) 11(-8.7,-3.735) 12(-8.7,-5.005) 13(-8.7,-6.275) 14(-8.7,-7.545) 25(8.7,-7.545) 26(8.7,-6.275) 27(8.7,-5.005) 28(8.7,-3.735) 29(8.7,-2.465) 30(8.7,-1.195) 31(8.7,0.075) 32(8.7,1.345) 33(8.7,2.615) 34(8.7,3.885) 35(8.7,5.155) 36(8.7,6.425) 37(8.7,7.695) 38(8.7,8.965)
  rect 0.9x2.4 smd: 15(-5.715,-8.965) 16(-4.445,-8.965) 17(-3.175,-8.965) 18(-1.905,-8.965) 19(-0.635,-8.965) 20(0.635,-8.965) 21(1.905,-8.965) 22(3.175,-8.965) 23(4.445,-8.965) 24(5.715,-8.965)
  rect 5x5 smd: 39(-1.017,1.422)

## Nets
As in the schematic.

Pads without a net: D1 5; SW1 1; U3 4; U5 2 3 4 5 6 7 12 14 15 16 17 19 21 22; U8 18; U10 4 5 6 7 8 9 10 16 17 18 19 20 21 22 26 27 28 29 30 31 32 36 37; U11 8 9 13 14; USB1 3 9

## Via types
v1: diameter 0.61, hole 0.305, Top Layer to Bottom Layer, 52 vias
v2: diameter 0.508, hole 0.305, Top Layer to Bottom Layer, 1 via
v3: diameter 0.5, hole 0.3, Top Layer to Bottom Layer, 1 via
v4: diameter 0.508, hole 0.299, Top Layer to Bottom Layer, 1 via

## Routing (per net, layer and track width the routed paths; a pad name or vN(x,y) marks a point on that pad's centre or on a via; arc(x,y) is an arc through that point)
GND: length 28
  Top Layer w0.254: 79.29,8.04 80.49,8.04 80.49,9.86 ; 76.69,13.77 77.34,13.77 ; 77.34,13.77 78.92,12.19 ; 77.34,13.77 77.99,13.77 ; v1(10.77,46.32) 10.77,44.62 9.41,43.27 ; U5.25 66.52,18.4 U5.1 ; U5.25 68.54,20.41 U5.11 70.91,20.41 C9.1 ; U5.25 66.53,20.92 U5.18 ; U5.25 68.04,19.41 U5.9 ; R33.2 7.68,31 v1(7.68,32.13) ; U8.10 79.18,12.89 79.9,12.17 ; U8.6 U8.7 81.13,12.32
  vias: v1(7.37,30.63) v1(7.5,41.86) v1(11.45,41.74) v1(18.64,20.74) v1(26.69,9.69) v1(42.93,21.73) v1(67.78,18.6) v1(71.66,17.13) v1(86.56,45.07) v1(88,38.82) v1(88.32,50.63) v1(92.45,34.88) v1(92.45,32.16)
V5+: length 116.3
  Top Layer w0.381: D2.1 19.14,18.79 19.14,14.97 19.98,14.13 25.07,14.13 v1(29.46,9.74)
  Top Layer w0.508: R4.2 R3.2 ; R3.2 R37.2 ; R3.2 95.9,32.8 U12.2 95.13,33.25 C5.2 87.77,33.25 86.18,31.66 U3.5 86.18,26.76 v1(82.31,22.9) ; C28.1 18.79,22.9 v1(20.95,20.74)
  Bottom Layer w0.508: v1(82.31,22.9) 84.47,20.73 84.47,14.44 82.97,12.94 32.66,12.94 v1(29.46,9.74)
V12-EN: length 92.1
  Top Layer w0.254: 89.85,11.45 C23.2
  Top Layer w0.508: 83.1,16.21 80.29,19.02 80.78,19.02 81.19,19.44 81.19,20.61 80.88,20.92 80.29,20.92 ; 83.1,16.21 83.67,16.78 89.73,16.78 91,15.51 91,14.44 90.34,13.77 C26.1 89.87,11.47 89.85,11.45 C24.2 ; 83.1,16.21 83.1,16.19 ; 83.1,16.19 82.92,16.38 79.23,16.38 78.53,15.68 U8.11 ; 83.1,16.19 v1(83.1,14.24) 83.08,14.22 U8.4 ; R39.2 29.33,13.98 31.3,13.98 U13.2 32.43,14.54 v1(33.16,13.8)
  Bottom Layer w0.508: v1(33.16,13.8) 38.7,19.34 81.02,19.34 82.54,17.82 82.54,14.79 v1(83.1,14.24)
VBUS: length 17.5
  Top Layer w0.508: v1(91.08,36) 92.42,36 92.45,35.97 95.02,35.97 U12.1
  Bottom Layer w0.508: v1(86.81,44.31) 86.81,41.23 ; 86.81,41.23 v1(88.29,39.74) ; 86.81,41.23 86.81,38.65 89.45,36 v1(91.08,36)
VCC3.3: length 78.6
  Top Layer w0.254: 69.02,21.93 69.02,22.18
  Top Layer w0.381: v1(44.2,4.48) 44.2,1.51 ; 44.2,1.51 46.52,1.51 C2.1 ; 44.2,1.51 C1.2 ; U5.8 70.47,18.91 71.23,18.16 71.25,18.16 ; 71.25,18.16 C11.1 C8.1 R38.2 76.33,18.16 77.19,19.02 78.09,19.02 77.12,19.99 73.46,19.99 72.84,20.61 72.84,21.7 72.1,22.44 69.54,22.44 69.02,21.93 U5.13 ; 71.25,18.16 69.77,16.68 R5.2 63.97,15.12 64.58,14.51 63.95,13.88 63.95,9.54 64.64,8.85 v1(65.47,8.85) ; R6.2 63.57,20.15 62.25,20.15 61.87,20.53 61.87,21.93 62.43,22.49 68.71,22.49 69.02,22.18
  Bottom Layer w0.254: v1(65.47,8.85) 47.59,8.85 44.2,5.46 v1(44.2,4.48)
BAT+: length 75.2
  Top Layer w0.381: Q2.3 Q2.2 Q2.1 10.05,14.96 R34.2
  Top Layer w0.508: Q2.3 9.36,12.09 7.95,13.51 7.55,13.51 7.05,14.01 7.05,17.87 3.75,21.17 3.75,35.31 7.47,39.03 U11.16 7.47,40.18 6.22,41.44 6.22,43.26 R42.1 7.67,48.66 R40.2 7.68,49.33 13.5,55.15 13.5,57.71 15.49,59.69 ; C32.2 4.89,27.11 4.89,21.86 8.8,17.95 R34.2
CC1: length 12.6
  Top Layer w0.152: USB1.4 88,40.91 89.6,40.91 91.84,43.15 91.84,48.29 90.15,49.98 D1.4
CC2: length 7.6
  Top Layer w0.203: 87.28,43.69 87.49,43.89 87.77,43.89 89.07,45.19 89.07,49.32 88.41,49.98 D1.3
D+: length 21.9
  Top Layer w0.152: U3.1 89.99,35.76 86.98,38.77 86.98,41.4 87.37,41.79 USB1.6
  Top Layer w0.203: v3(87.42,50.74) 87.97,51.28 D1.1 ; v4(88.89,41.95) 87.8,41.95 ; v2(88.87,44) 87.6,42.74 USB1.8
  Bottom Layer w0.203: v4(88.89,41.95) 88.89,43.98 v2(88.87,44) 88.87,48.86 87.42,50.3 v3(87.42,50.74)
D-: length 22.8
  Top Layer w0.152: 89.38,43.49 89.38,49.49 89.12,49.74 89.12,50.94 89.1,50.96 89.42,51.28 D1.6 ; U3.2 88.72,36.67 86.73,38.66 86.73,41.79 87.2,42.26 USB1.7 87.71,42.26 87.86,42.42 88.32,42.42 89.38,43.47 89.38,41.75 89.04,41.41 87.88,41.41 USB1.5
D_EN: length 35.2
  Top Layer w0.254: U8.26 83.73,6.89 83.43,6.58 82.43,6.58 ; 82.43,6.58 81.53,6.58 81.13,6.98 U8.22 ; 82.43,6.58 U8.24
  Bottom Layer w0.254: v1(55.63,4.48) 55.63,4.92 58.95,8.24 80.51,8.24 v1(81.13,8.86)
D_PWM_U: length 27.1
  Bottom Layer w0.508: v1(59.44,4.48) 59.44,5.35 60.62,6.54 82.56,6.54 v1(84.38,8.36)
D_PWM_V: length 27
  Bottom Layer w0.508: v1(83.08,8.36) 81.87,7.15 60.06,7.15 58.17,5.25 v1(58.17,4.48)
D_PWM_W: length 26.9
  Bottom Layer w0.508: v1(81.78,8.36) 81.18,7.76 59.45,7.76 56.9,5.2 v1(56.9,4.48)
E-EN: length 27.9
  Top Layer w0.508: 67.89,7.8 67.84,7.85 65.48,7.85 65.49,7.84 RESET.1 65.42,5.22 62.76,2.55 45.94,2.55 45.47,3.03 45.47,4.48
IO0: length 51.2
  Top Layer w0.254: 65.49,14.51 BOOT.1
  Top Layer w0.381: v1(59.44,21.88) 59.44,23.57 59.3,23.71 42.31,23.71 41.93,23.33 41.93,20.31 42.31,19.92 54.73,19.92 v1(58.34,16.32)
  Bottom Layer w0.381: v1(65.39,14.51) 63.59,16.32 v1(58.34,16.32)
P_ADC: length 54.1
  Top Layer w0.254: R42.2 8.53,41.88 v1(8.55,41.86)
  Bottom Layer w0.254: v1(8.55,41.86) 8.55,37.99 23.97,22.57 48.96,22.57 v1(49.34,22.19)
RXD0: length 60.2
  Top Layer w0.254: v1(88.72,31.53) U3.7 88.72,26.12 89.96,24.88 95.4,24.88 96.01,25.49 TTL.1
  Bottom Layer w0.254: v1(88.72,31.53) 88.13,32.12 87.22,32.12 86.61,31.51 86.61,30.81 77.1,21.3 48.38,21.3 v1(48,21.68)
SCL0: length 5.2
  Top Layer w0.254: U5.24 64.99,17.63 U10.23
SDA0: length 4.9
  Top Layer w0.254: U10.24 65.76,18.9 U5.23
TXD0: length 62
  Top Layer w0.254: TTL.3 96.85,25.07 96.31,24.52 89.81,24.52 87.44,26.88 U3.6 87.44,31.51 v1(87.47,31.53)
  Bottom Layer w0.254: v1(87.47,31.53) 87.47,30.95 77.34,20.81 47.06,20.81 v1(46.75,21.12)
U: length 13.4
  Top Layer w0.254: v1(81.83,15.48) 82.43,14.88 U8.5
  Bottom Layer w0.381: CN1.1 72.62,14.58 73.5,13.7 80.61,13.7 81.83,14.92 v1(81.83,15.48)
V: length 11
  Top Layer w0.254: v1(80.8,15.48) 80.48,15.17 U8.8
  Bottom Layer w0.381: CN1.2 73.42,14.79 74.03,14.19 80.06,14.19 80.8,14.92 v1(80.8,15.48)
W: length 7.8
  Top Layer w0.254: v1(79.85,15.48) 79.83,15.46 U8.9
  Bottom Layer w0.381: CN1.3 75.33,14.67 79.04,14.67 v1(79.85,15.48)
$1N4426: length 3.2
  Top Layer w0.254: C6.1 91.83,28.84 91.03,28.84 U3.8
$1N4742: length 2.2
  Top Layer w0.254: R3.1 95.9,27.54 TTL.2
$1N4768: length 2.4
  Top Layer w0.254: TTL.4 97.45,28.03 R4.1
$1N6012: length 1.9
  Top Layer w0.254: U5.10 71.5,19.91 C9.2
$1N6344: length 2.2
  Top Layer w0.254: C10.1 64.53,21.13 65.25,20.41 U5.20
$1N6735: length 3.2
  Top Layer w0.254: 78.09,20.92 76.21,22.8 C12.1
$1N10947: length 3.4
  Top Layer w0.254: 76.69,8.04 77.92,8.04 77.92,5.97 77.99,5.9
$1N11170: length 2.4
  Top Layer w0.254: 85.14,13.77 C25.2
$1N11174: length 4.5
  Top Layer w0.254: 87.58,14.86 87.07,15.38 84.73,15.38 84.38,15.04 84.38,14.13
$1N11246: length 7.7
  Top Layer w0.254: U8.3 83.73,15.1 84.37,15.73 89,15.73 89.87,14.86
$1N21068: length 8.2
  Top Layer w0.381: R26.1 30.32,5.22 29.11,4 Q1.4
$1N21616: length 10.3
  Top Layer w0.381: Q2.8 Q2.7 Q2.6 Q2.5 16.73,9.94 Q3.6 ; Q3.6 Q3.7 Q3.8 ; Q3.6 Q3.5
$1N22205: length 3.2
  Top Layer w0.381: R29.1 11.87,9 Q2.4
$1N22284: length 17
  Top Layer w0.254: 8.12,33.95 8.12,35.22 v1(7.87,35.47)
  Bottom Layer w0.254: v1(7.87,35.47) 7.74,35.47 7,34.73 6.52,34.73 6.24,35.01 6.24,42.07 8.83,44.66 v1(11.44,44.66)
$1N22287: length 26.8
  Bottom Layer w0.254: v1(8.77,33.92) 8.77,13.53 v1(13.3,9)
$1N22338: length 2.2
  Top Layer w0.254: 9.42,33.95 9.42,33 R30.2
$1N22413: length 3.6
  Top Layer w0.254: C30.2 10.07,31.55 10.07,33.95
$1N22416: length 3.2
  Top Layer w0.254: 10.72,33.95 10.72,32.39 11.27,31.84 12.02,31.84 C31.2
$1N22526: length 13.2
  Top Layer w0.254: U11.10 11.37,38.82 10.66,38.11 7.79,38.11 5.34,35.66 R31.2
$1N22587: length 2.1
  Top Layer w0.254: 10.72,41.82 U11.11
$1N22677: length 28.5
  Top Layer w0.254: R33.1 7.37,28.5 C32.1 ; R33.1 9.44,29.82 C30.1 12.36,30.68 12.84,31.17 12.84,32.14 12.46,32.52 12.08,32.52 11.37,33.23 11.37,36.82 12.79,38.24 12.79,41.9 12.16,42.53 10,42.53 9.59,42.12 9.59,41.15 10.07,40.67 U11.12 ; R33.1 R31.1
  Top Layer w0.381: 12.04,30.68 C31.1
$1N22806: length 28.2
  Top Layer w0.254: R34.1 7.94,17.82 4.23,21.53 4.23,35.11 8.12,39 U11.15
  Top Layer w0.381: C33.1 7.95,16.19 R34.1
$1N23187: length 58.1
  Top Layer w0.381: BAT_Reset.1 12.31,47.54 R28.1 R27.1 13.71,41.79 13.71,23.18 18.41,18.48 18.41,14.84 19.6,13.65 24.25,13.65 25.34,12.56 25.34,10.53 24.76,9.94 Q3.3 Q3.2 Q3.1 26.13,5.27 Q1.3 Q1.2 Q1.1
$1N23372: length 39.4
  Top Layer w0.508: Q1.5 Q1.6 Q1.7 Q1.8 34.05,8.88 34.05,21.3 33.06,22.29 29.53,22.29 SW1.2 26.36,22.21 22.73,22.21 22.34,21.83 22.34,18.24 C29.1 21.83,15.65 D2.2
$1N23637: length 47.6
  Top Layer w0.254: 7.47,33.95 7.47,34.82 v1(6.83,35.47)
  Bottom Layer w0.254: 6.83,35.67 7.87,36.71 8.76,36.71 9.67,35.8 9.67,25.54 v1(24,11.21) ; 6.83,35.67 6.83,42.07 7.94,43.19 v1(11.44,43.19) ; 6.83,35.67 v1(6.83,35.47)
$1N23749: length 2
  Top Layer w0.254: R37.1 94.17,27.78 V5+.2
$1N23775: length 2.9
  Top Layer w0.254: V3.3.2 78.57,17.29 R38.1
$1N23930: length 1.5
  Top Layer w0.254: 28.5,14.06 28.5,15.55
$1N24036: length 2.6
  Top Layer w0.254: R40.1 9.17,48.05 BAT.2
$1N25830: length 8.1
  Top Layer w0.508: SW1.3 27.69,18.88 30.78,18.88 31.86,17.8 U13.1

## Copper pours and planes (outline as drawn; the poured copper is in the pictures)
GND on Top Layer: -4.29,105.62 102.1,105.62 102.1,-3.16 -4.29,-3.16
GND on Bottom Layer: -4.15,105.29 102.86,105.29 102.86,-4.05 -4.15,-4.05
